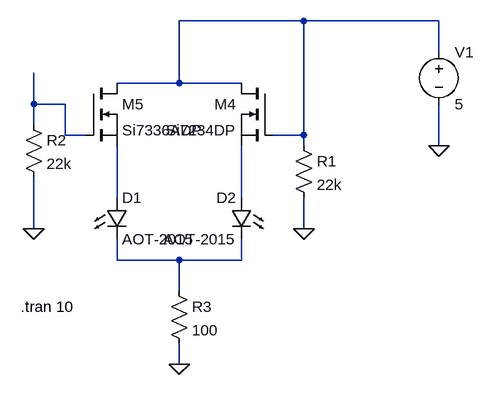
[diagram p0: schematic TSAL_indicator.asc]
TSAL_indicator.asc, the LTspice schematic file:
Version 4
SHEET 1 880 680
WIRE 432 48 240 48
WIRE 640 48 432 48
WIRE 640 96 640 48
WIRE 240 144 240 48
WIRE 240 144 144 144
WIRE 336 144 240 144
WIRE 16 176 16 128
WIRE 64 176 16 176
WIRE 16 208 16 176
WIRE 64 224 64 176
WIRE 96 224 64 224
WIRE 432 224 432 48
WIRE 432 224 384 224
WIRE 432 240 432 224
WIRE 640 240 640 176
WIRE 144 320 144 240
WIRE 336 320 336 240
WIRE 16 368 16 288
WIRE 432 368 432 320
WIRE 144 416 144 384
WIRE 240 416 144 416
WIRE 336 416 336 384
WIRE 336 416 240 416
WIRE 240 464 240 416
WIRE 240 576 240 544
FLAG 640 240 0
FLAG 432 368 0
FLAG 16 368 0
FLAG 240 576 0
SYMBOL nmos 384 144 M0
SYMATTR InstName M4
SYMATTR Value Si7234DP
SYMBOL nmos 96 144 R0
SYMATTR InstName M5
SYMATTR Value Si7336ADP
SYMBOL voltage 640 80 R0
WINDOW 123 0 0 Left 0
WINDOW 39 0 0 Left 0
SYMATTR InstName V1
SYMATTR Value 5
SYMBOL res 416 224 R0
SYMATTR InstName R1
SYMATTR Value 22k
SYMBOL res 0 192 R0
SYMATTR InstName R2
SYMATTR Value 22k
SYMBOL LED 128 320 R0
SYMATTR InstName D1
SYMATTR Value AOT-2015
SYMBOL LED 352 320 M0
SYMATTR InstName D2
SYMATTR Value AOT-2015
SYMBOL res 224 448 R0
SYMATTR InstName R3
SYMATTR Value 100
TEXT -4 488 Left 2 !.tran 10

The netlist it stands for:
* TSAL_indicator.asc
M4 N001 N001 N004 N004 Si7234DP
M5 N001 N002 N003 N003 Si7336ADP
V1 N001 0 5
R1 N001 0 22k
R2 N002 0 22k
D1 N003 N005 AOT-2015
D2 N004 N005 AOT-2015
R3 N005 0 100
.model D D
.lib standard.dio
.model NMOS NMOS
.model PMOS PMOS
.lib standard.mos
.tran 10
.backanno
.end